# EAGLE design mapleCUL_small-V10_59 (EAGLE 7.6.0)
MAPLE-CUx Large Version
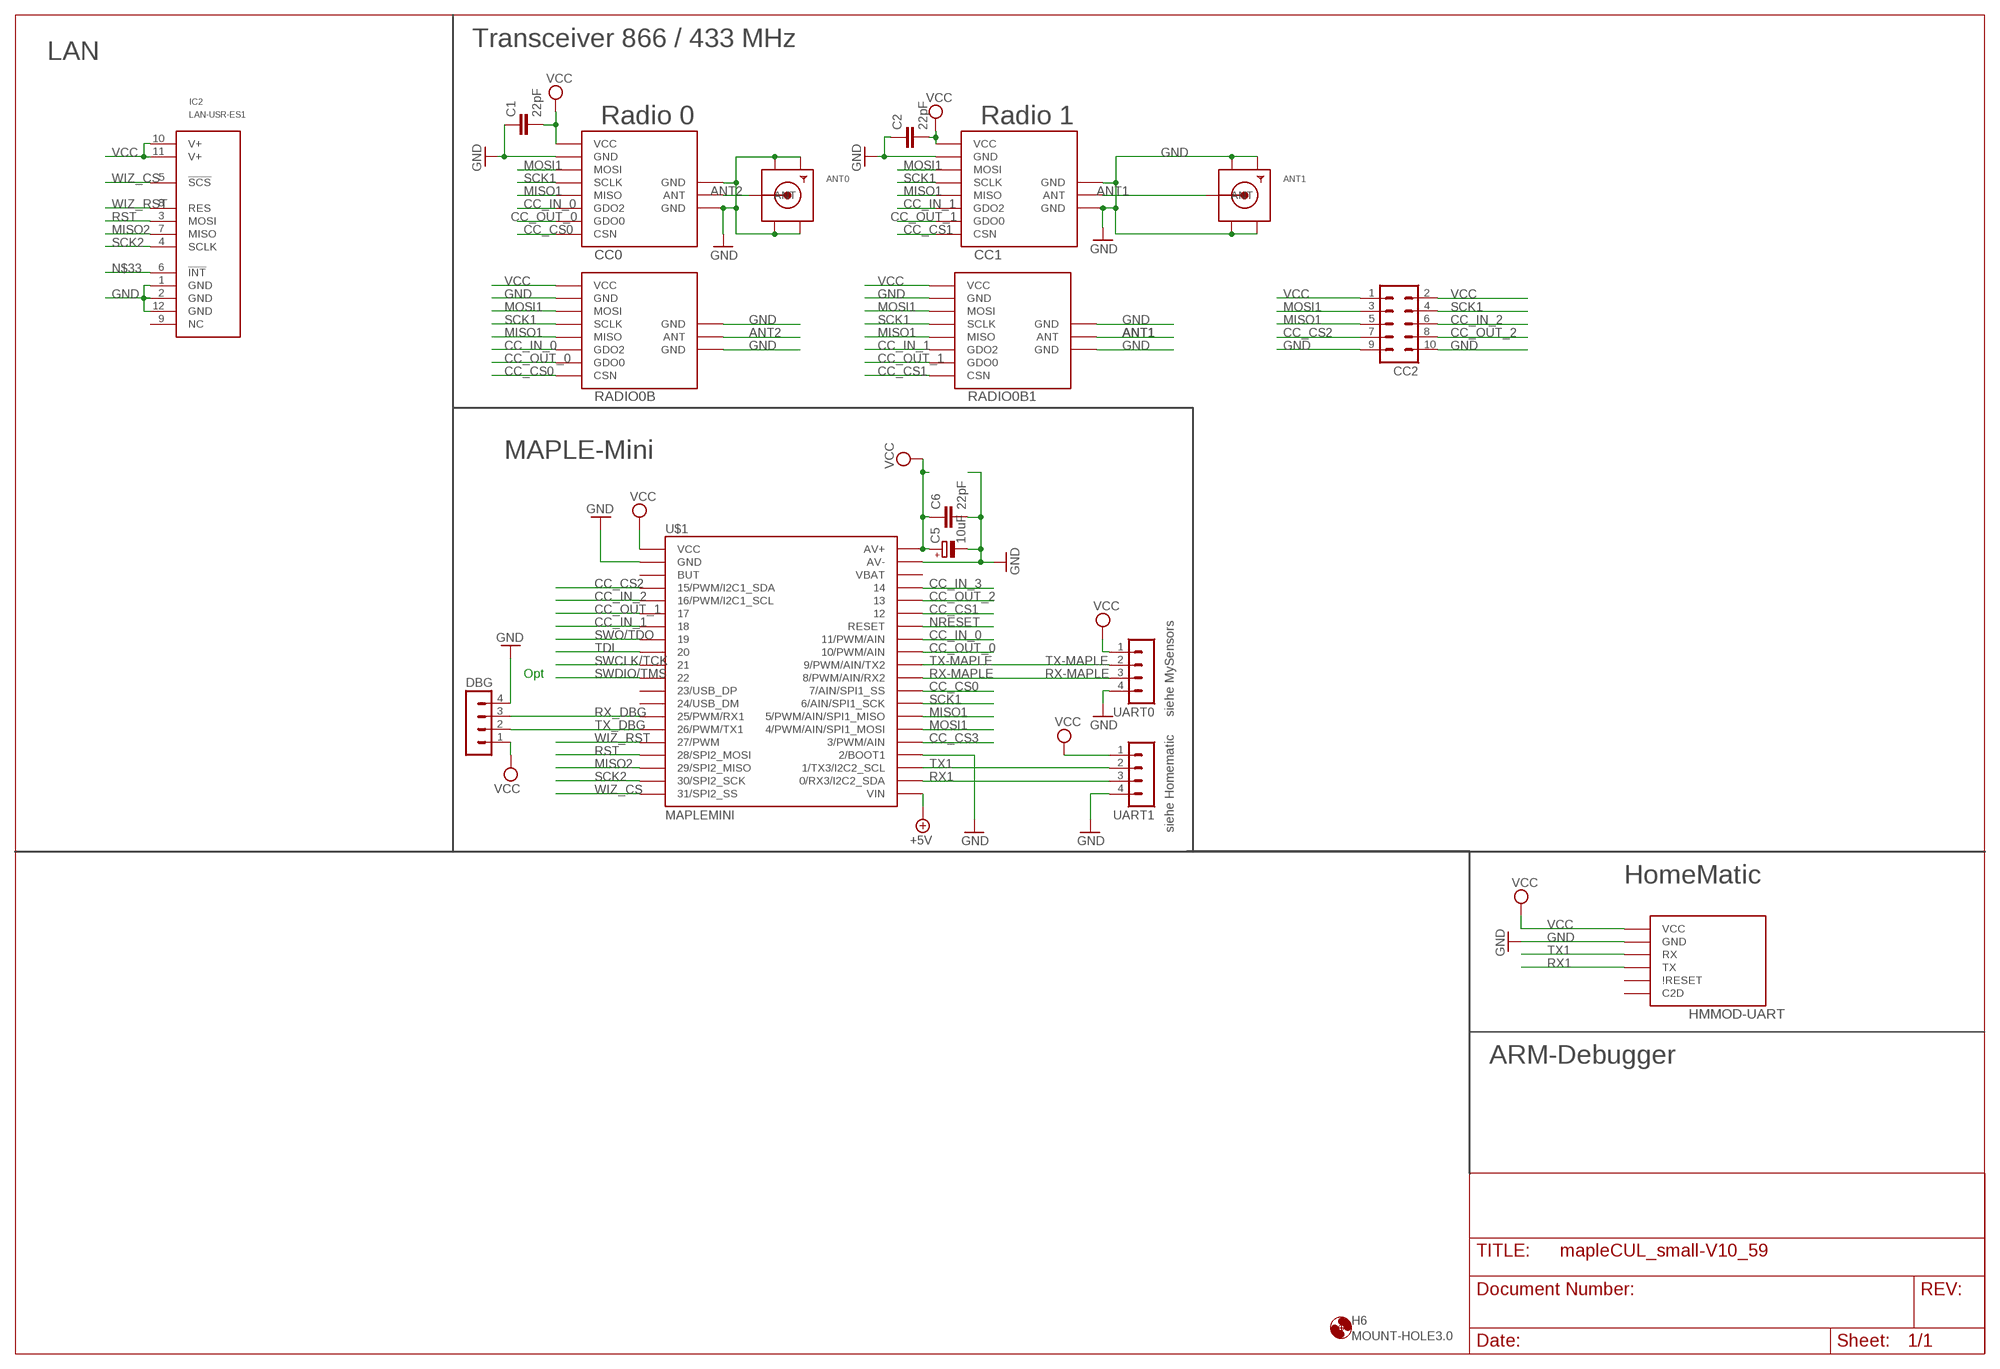
[diagram p0: schematic, sheet 1]

## Parts
ANT0  SMACONNECTOR_EDGE_UFL  [SMA_EDGELAUNCH_UFL]
ANT1  SMACONNECTOR_EDGE_UFL  [SMA_EDGELAUNCH_UFL]
C1  22pF  C-EUC0805  [C0805]
C2  22pF  C-EUC0805  [C0805]
C5  10uF  CPOL-EUR/2012-12W  [R/2012-12W]
C6  22pF  C-EUC0805  [C0805]
CC0  CC1101  CC1101_MODULE1SMD  [CC1101_MODULE1_SMD]
CC1  CC1101_MODULE1SMD  [CC1101_MODULE1_SMD]
CC2  MA05-2  [MA05-2]
DBG  MA04-1  [MA04-1]
H6  MOUNT-HOLE3.0  [3,0]
HMMOD-UART  HM-MOD-UARTDIL  [HM-MOD-UART-DIL]
IC2  LAN-USR-ES1  [USR-ES1]
RADIO0B  CC1101_MODULE1SMALL  [CC1101_MODULE1_SMD]
RADIO0B1  CC1101_MODULE1SMD  [CC1101_MODULE1_SMD]
U$1  MAPLEMINI  [20-DIP]
UART0  MA04-1  [MA04-1]
UART1  MA04-1  [MA04-1]

## Nets
+5V [PWR]: U$1.21(VIN)
ANT1 [PWR]: ANT1.P(ANT) CC1.ANT RADIO0B1.ANT
ANT2: ANT0.P(ANT) CC0.ANT RADIO0B.ANT
CC_CS0: CC0.CSN RADIO0B.CSN U$1.29(7/AIN/SPI1_SS)
CC_CS1: CC1.CSN RADIO0B1.CSN U$1.35
CC_CS2: CC2.7 U$1.4(15/PWM/I2C1_SDA)
CC_CS3: U$1.25(3/PWM/AIN)
CC_IN_0: CC0.GDO2 RADIO0B.GDO2 U$1.33(11/PWM/AIN)
CC_IN_1: CC1.GDO2 RADIO0B1.GDO2 U$1.7
CC_IN_2: CC2.6 U$1.5(16/PWM/I2C1_SCL)
CC_IN_3: U$1.37
CC_OUT_0: CC0.GDO0 RADIO0B.GDO0 U$1.32(10/PWM/AIN)
CC_OUT_1: CC1.GDO0 RADIO0B1.GDO0 U$1.6
CC_OUT_2: CC2.8 U$1.36
GND [PWR]: ANT0.GND@1(GND1) ANT0.GND@2(GND2) ANT0.GND@3(GND3) ANT0.GND@4(GND4) ANT1.GND@1(GND1) ANT1.GND@2(GND2) ANT1.GND@3(GND3) ANT1.GND@4(GND4) C1.1 C2.1 C5.- C6.2 CC0.GND@0(GND) CC0.GND@1(GND) CC0.GND@2(GND) CC1.GND@0(GND) CC1.GND@1(GND) CC1.GND@2(GND) CC2.9 CC2.10 DBG.4 HMMOD-UART.2(GND) IC2.1(GND) IC2.2(GND) IC2.12(GND) RADIO0B1.GND@0(GND) RADIO0B1.GND@1(GND) RADIO0B1.GND@2(GND) RADIO0B.GND@0(GND) RADIO0B.GND@1(GND) RADIO0B.GND@2(GND) U$1.2(GND) U$1.24(2/BOOT1) U$1.39(AV-) UART0.4 UART1.4
MISO1: CC0.MISO CC1.MISO CC2.5 RADIO0B1.MISO RADIO0B.MISO U$1.27(5/PWM/AIN/SPI1_MISO)
MISO2: IC2.7(MISO) U$1.18(29/SPI2_MISO)
MOSI1: CC0.MOSI CC1.MOSI CC2.3 RADIO0B1.MOSI RADIO0B.MOSI U$1.26(4/PWM/AIN/SPI1_MOSI)
N$33: IC2.6(!INT!)
NRESET: U$1.34(RESET)
RST: IC2.3(MOSI) U$1.17(28/SPI2_MOSI)
RX1: HMMOD-UART.5(TX) U$1.22(0/RX3/I2C2_SDA) UART1.3
RX-MAPLE: U$1.30(8/PWM/AIN/RX2) UART0.3
RX_DBG: DBG.3 U$1.14(25/PWM/RX1)
SCK1: CC0.SCLK CC1.SCLK CC2.4 RADIO0B1.SCLK RADIO0B.SCLK U$1.28(6/AIN/SPI1_SCK)
SCK2: IC2.4(SCLK) U$1.19(30/SPI2_SCK)
SWCLK/TCK: U$1.10
SWDIO/TMS: U$1.11
SWO/TDO: U$1.8
TDI: U$1.9
TX1: HMMOD-UART.6(RX) U$1.23(1/TX3/I2C2_SCL) UART1.2
TX-MAPLE: U$1.31(9/PWM/AIN/TX2) UART0.2
TX_DBG: DBG.2 U$1.15(26/PWM/TX1)
VCC [PWR]: C1.2 C2.2 C5.+ C6.1 CC0.VCC CC1.VCC CC2.1 CC2.2 DBG.1 HMMOD-UART.1(VCC) IC2.10(V+) IC2.11(V+) RADIO0B1.VCC RADIO0B.VCC U$1.1(VCC) U$1.40(AV+) UART0.1 UART1.1
WIZ_CS: IC2.5(!SCS!) U$1.20(31/SPI2_SS)
WIZ_RST: IC2.8(RES) U$1.16(27/PWM)
Unconnected: HMMOD-UART.3(C2D) HMMOD-UART.4(\!RESET) IC2.9(NC) U$1.3(BUT) U$1.12(23/USB_DP) U$1.13(24/USB_DM) U$1.38(VBAT)

## Notes on the sheet
- Transceiver 866 / 433 MHz
- LAN
- Radio 0 | Radio 1
- MAPLE-Mini
- Opt
- siehe MySensors
- siehe Homematic
- HomeMatic
- ARM-Debugger

## Library data of the parts
ANT0 ANT1 = adafruit:SMACONNECTOR: SMA Connector 90° DIP SMA Connector, 50 Ohm (4UConnector: 07259)
C1 C2 C6 = rcl:C-EU: CAPACITOR, European symbol
C5 = rcl:CPOL-EU: POLARIZED CAPACITOR, European symbol
CC0 CC1 = wireless:CC1101_MODULE1: CC1101 wireless module for 433/868 MHz (sold from Aliexpress). DIL version for mounting with pin header (and SMD soldering) and SMD only variant available.
CC2 = con-lstb:MA05-2: PIN HEADER; OC_FARNELL: unknown; OC_NEWARK: unknown
DBG UART0 UART1 = con-lstb:MA04-1: PIN HEADER; OC_FARNELL: unknown; OC_NEWARK: unknown
H6 = holes:MOUNT-HOLE: MOUNTING HOLE with drill center marker
HMMOD-UART = wireless:HM-MOD-UART: eQ3 HM-MOD-UART-AW-SH2 wireless module for 868 MHz. DIL version for mounting with pin header (antenna upwards) and SMD variant available (antenna downwards).
IC2 = Martin-Communication:LAN-USR-ES1
RADIO0B RADIO0B1 = Martin-Communication:CC1101_MODULE1: CC1101 wireless module for 433/868 MHz (sold from Aliexpress). DIL version for mounting with pin header (and SMD soldering) and SMD only variant available.
U$1 = maplemini-small:MAPLEMINI

## Net classes
0 default: width 0.305 mm
1 PWR: width 0.406 mm

## Board
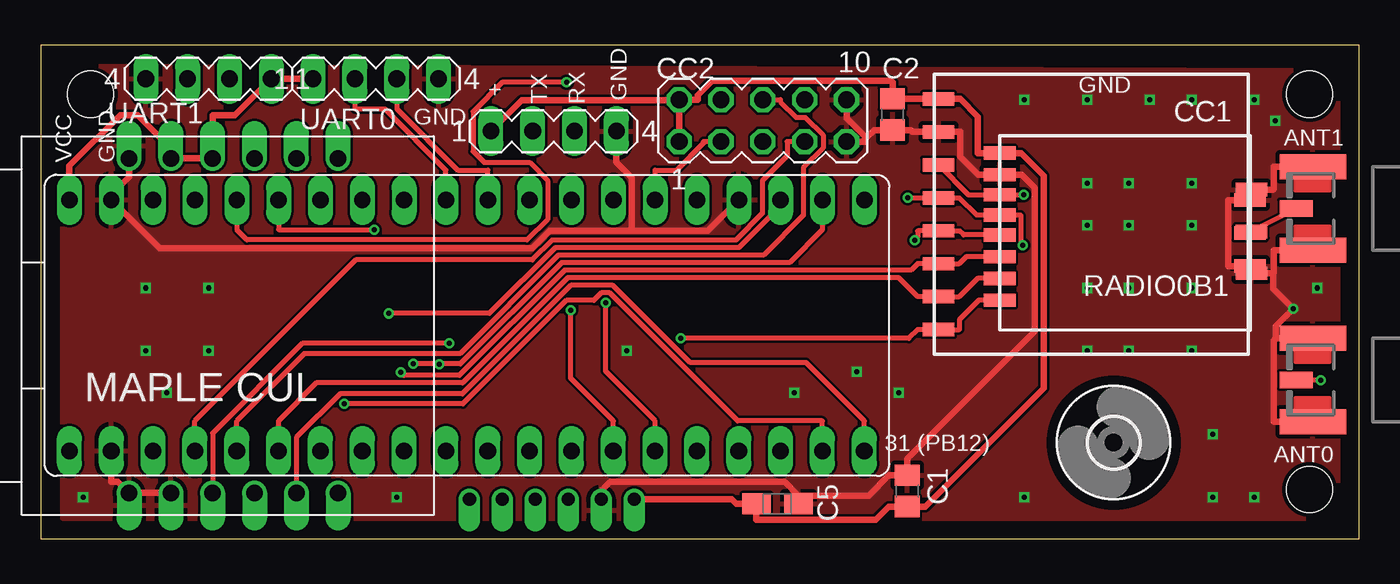
[diagram p1: board, top side]
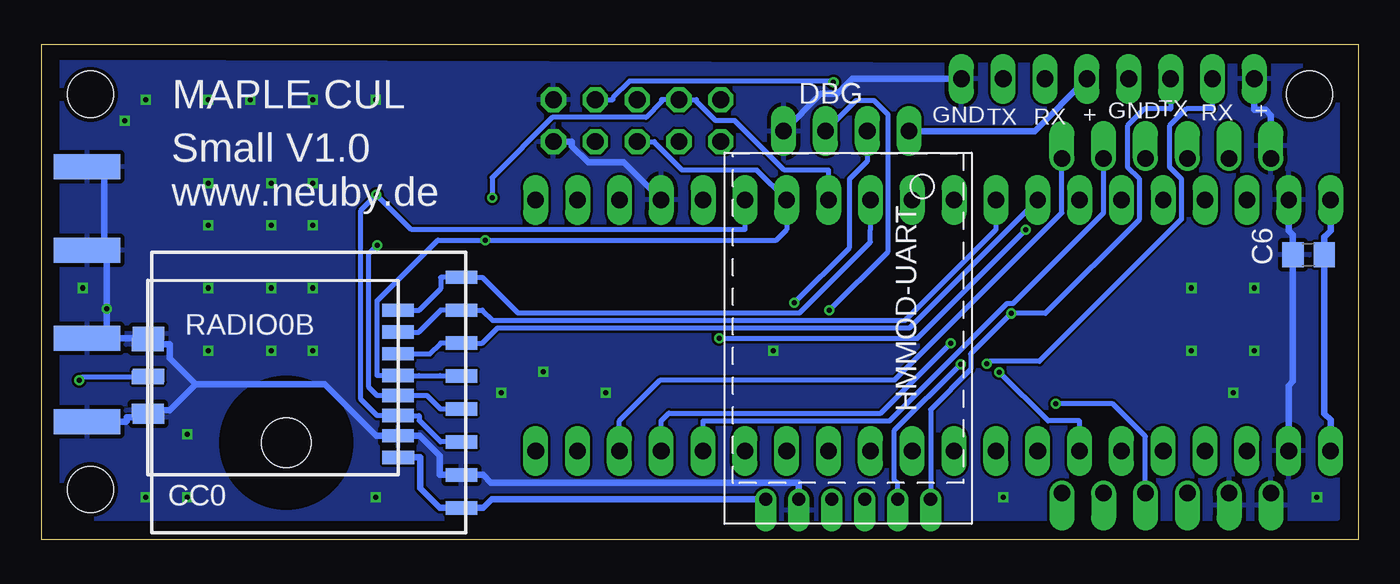
[diagram p2: board, bottom side, seen from below]

Size 80 x 30 mm. Coordinates in mm from the lower left corner, seen from the top.
Outline: 0,0 0,30 80,30 80,0 1,0 0,0
Copper layers (1*16): Top 0.035mm / dielectric 1.5mm / Bottom 0.035mm
Design rules "Fusion_eagle_rule_v1.1": minimum track width 6mil, minimum drill 12mil, track to track 6mil, track to pad 6mil, pad to pad 6mil, via to via 6mil, smd to smd 0mil, copper to edge 10mil, drill to drill 10mil, minimum pad ring 10mil, minimum via ring 6mil, stop-mask expansion 2mil, vias tented up to drill 100mil, thermal gap 10mil
Holes 2.8 mm at 3,27 77,27 77,3
tRestrict: 1 lines
bRestrict: 1 lines

### Footprints (pad centres in the part's own frame; a part is rotated, then mirrored left to right if it is on the bottom)
SMA_EDGELAUNCH_UFL = smd 4.064 x 1.524: GND@1 2.032,-2.54; GND@2 2.032,2.54 | smd 4.064 x 1.524 bottom: GND@3 2.032,2.54; GND@4 2.032,-2.54 | smd 2.032 x 1.016: P 3.048,0
C0805 = smd 1.3 x 1.5: 1 -0.95,0; 2 0.95,0
R/2012-12W = smd 1.75 x 1.26: + 1.275,0; - -1.275,0
CC1101_MODULE1_SMD = smd 1.93 x 0.813: ANT 19,5.96; CSN 0,0; GDO0 0,2; GDO2 0,4; GND@0 0,12; GND@1 19,8.5; GND@2 19,3.42; MISO 0,6; MOSI 0,10; SCLK 0,8; VCC 0,14
MA05-2 = drill 1.016 octagon: 1 -5.08,-1.27; 2 -5.08,1.27; 3 -2.54,-1.27; 4 -2.54,1.27; 5 0,-1.27; 6 0,1.27; 7 2.54,-1.27; 8 2.54,1.27; 9 5.08,-1.27; 10 5.08,1.27
MA04-1 = drill 1.016 long: 1 -3.81,0; 2 -1.27,0; 3 1.27,0; 4 3.81,0
3,0 = hole 3: 0,0
HM-MOD-UART-DIL = drill 0.8 offset: 1 0,12; 2 0,10; 3 0,8; 4 0,6; 5 0,4; 6 0,2
USR-ES1 = drill 1 pad 1.35 offset: 1 -10.16,5.715; 2 -10.16,3.175; 3 -10.16,0.635; 4 -10.16,-1.905; 5 -10.16,-4.445; 6 -10.16,-6.985; 7 10.16,-6.985; 8 10.16,-4.445; 9 10.16,-1.905; 10 10.16,0.635; 11 10.16,3.175; 12 10.16,5.715
CC1101_MODULE1_SMD' = smd 1.93 x 0.813: ANT 14.889,4.381; CSN -0.305,0.305; GDO0 -0.305,1.626; GDO2 -0.305,2.946; GND@0 -0.305,7.925; GND@1 14.889,6.381; GND@2 14.889,2.381; MISO -0.305,4.267; MOSI -0.305,6.706; SCLK -0.305,5.486; VCC -0.318,9.238
20-DIP = drill 1.016 pad 1.27 long: 1 -24.13,-7.62; 2 -21.59,-7.62; 3 -19.05,-7.62; 4 -16.51,-7.62; 5 -13.97,-7.62; 6 -11.43,-7.62; 7 -8.89,-7.62; 8 -6.35,-7.62; 9 -3.81,-7.62; 10 -1.27,-7.62; 11 1.27,-7.62; 12 3.81,-7.62; 13 6.35,-7.62; 14 8.89,-7.62; 15 11.43,-7.62; 16 13.97,-7.62; 17 16.51,-7.62; 18 19.05,-7.62; 19 21.59,-7.62; 20 24.13,-7.62 | drill 1 pad 1.27 long: 21 24.13,7.62; 22 21.59,7.62; 23 19.05,7.62; 24 16.51,7.62; 25 13.97,7.62; 26 11.43,7.62; 27 8.89,7.62; 28 6.35,7.62; 29 3.81,7.62; 30 1.27,7.62; 31 -1.27,7.62; 32 -3.81,7.62; 33 -6.35,7.62; 34 -8.89,7.62; 35 -11.43,7.62; 36 -13.97,7.62; 37 -16.51,7.62; 38 -19.05,7.62; 39 -21.59,7.62; 40 -24.13,7.62

### Placement (x,y rotation side)
ANT0  79.25,9.65 180 top
ANT1  79.25,20.07 180 top
C1  52.58,2.92 270 top
C2  51.69,25.78 90 top
C5  44.7,2.14 180 top
C6  3.05,17.26 180 bottom
CC0  54.48,15.89 180 bottom
CC1  54.48,12.72 0 top
CC2  43.81,25.4 0 top
DBG  31.11,24.77 0 top
H6  65.11,5.85 0 top
HMMOD-UART  24,2.41 90 bottom
IC2  11.05,12.95 90 top
RADIO0B  CC1101_MODULE1SMALL  [CC1101_MODULE1_SMD']  58.63,14.19 180 bottom
RADIO0B1  CC1101_MODULE1SMD  [CC1101_MODULE1_SMD']  58.51,14.19 0 top
U$1  25.84,12.97 0 top
UART0  20.32,27.94 0 top
UART1  10.16,27.94 180 top

### Tracks (layer width: path | path; a pad name or v marks a point on that pad's centre or on a via)
ANT1
  Top 0.305: CC1.ANT ANT1.P
  Top 0.406: RADIO0B1.ANT CC1.ANT
ANT2  (via drill 0.3 pad 0.61)
  Top 0.305: v77.7,9.65 ANT0.P
  Bottom 0.305: v77.7,9.65 77.54,9.81 RADIO0B.ANT 73.48,9.85 CC0.ANT
CC_CS0
  Bottom 0.305: RADIO0B.CSN 57.06,13.89 55.75,15.2 55.75,15.89 CC0.CSN 54.28,15.89 53.21,15.89 51.05,13.73 33.95,13.73 29.65,18.03 29.65,18.78 U$1.29
CC_CS1  (via drill 0.3 pad 0.61)
  Top 0.305: v38.83,12.19 52.69,12.19 53.21,12.72 CC1.CSN 55.75,12.72 55.75,13.32 56.93,14.5 RADIO0B1.CSN | v20.22,18.78 14.41,18.78 U$1.35
  Bottom 0.305: v38.83,12.19 26.81,12.19 v20.22,18.78
CC_CS2
  Top 0.305: CC2.7 45.29,24.13 45.29,23.25 43.79,21.75 43.79,19.77 42.17,18.15 31.02,18.15 29.82,16.94 19.1,16.94 9.34,7.18 U$1.4
CC_IN_0
  Bottom 0.305: U$1.33 27.27,12.81 52.29,12.81 53.21,11.89 CC0.GDO2 55.75,11.89 56.4,11.25 RADIO0B.GDO2
CC_IN_1  (via drill 0.3 pad 0.61)
  Top 0.305: v21.82,10.13 22.02,9.94 25.4,9.94 31.78,16.32 52.82,16.32 53.21,16.72 CC1.GDO2 55.75,16.72 56.18,17.14 RADIO0B1.GDO2
  Bottom 0.305: v21.82,10.13 18.87,7.18 16.95,7.18 U$1.7
CC_IN_2
  Top 0.305: CC2.6 44.88,26.67 44.88,26.56 45.84,25.6 46.4,25.6 47.47,24.53 47.47,23.73 46.28,22.55 46.28,19.66 43.86,17.24 31.4,17.24 25.43,11.26 15.96,11.26 11.87,7.18 U$1.5
CC_OUT_0
  Bottom 0.305: U$1.32 22.04,18.78 27.54,13.27 52.59,13.27 53.21,13.89 CC0.GDO0 55.75,13.89 57.06,12.58 57.06,12.57 RADIO0B.GDO0
CC_OUT_1
  Top 0.305: U$1.6 14.41,7.18 16.71,9.48 25.59,9.48 31.97,15.86 52.06,15.86 53.21,14.72 CC1.GDO0 55.75,14.72 56.86,15.82 RADIO0B1.GDO0
CC_OUT_2  (via drill 0.3 pad 0.61)
  Top 0.305: v31.89,27.73 27.99,27.73 26.22,25.95 26.22,23.54 26.9,22.86 29.65,22.86 30.74,21.77 30.74,19.39 29.51,18.16 12.49,18.16 11.87,18.78 U$1.36
  Bottom 0.305: CC2.8 45.29,26.67 45.29,26.78 44.27,27.8 31.97,27.8 v31.89,27.73
GND  (via drill 0.3 pad 0.61)
  Top 0.406: 35.87,18.72 30.88,18.72 29.8,17.65 7.2,17.65 U$1.39 4.25,20.93 5.33,22 IC2.12 | U$1.24 40.48,18.72 35.87,18.72 | 35.87,18.72 35.87,21.94 34.92,22.89 DBG.4 | U$1.2 4.25,3.47 4.66,3.47 IC2.1 IC2.2 | ANT1.GND@1 74.83,22.61 74.83,21.24 74.8,21.22 CC1.GND@1 73.48,20.66 RADIO0B1.GND@1 72.08,20.57 72.08,16.57 RADIO0B1.GND@2 73.4,16.22 CC1.GND@2 74.8,16.14 | ANT1.GND@3 74.83,17.53 74.83,16.16 74.8,16.14 | 74.8,16.14 74.8,15.2 v76.02,13.98 74.97,12.92 74.97,12.19 | 45.98,2.64 45.15,3.47 34.55,3.47 34,2.92 HMMOD-UART.2 | ANT0.GND@2 74.83,7.11 74.83,12.05 74.97,12.19 | 45.98,2.64 50.24,2.64 51.47,3.87 C1.1 52.58,4.88 60.32,12.62 60.32,21.32 59.52,22.12 RADIO0B1.GND@0 56.88,22.12 55.8,23.2 55.8,24.72 CC1.GND@0 52.91,24.72 52.8,24.83 C2.1 50.72,24.83 50.58,24.83 50.1,24.35 | C5.- 45.98,2.64 | ANT0.GND@1 74.97,12.19 | 50.1,24.35 50.01,24.26 50.01,24.13 CC2.9 | 50.1,24.35 48.9,25.55 CC2.10
  Bottom 0.406: 73.06,7.81 CC0.GND@1 74.8,7.39 74.8,7.14 74.83,7.11 ANT0.GND@2 | RADIO0B.GND@1 73.06,7.81 | 73.06,7.81 72.86,7.81 72.2,7.81 70.62,9.4 | CC2.9 47.78,24.13 47.78,23.86 46.8,22.88 44.64,22.88 U$1.24 | UART0.4 30.75,27.94 31.66,27.03 32.66,27.03 DBG.4 | U$1.39 4.25,18.73 4,18.47 C6.2 4,9.57 4.25,9.32 4.25,7.23 U$1.2 | 70.62,9.4 62.78,9.4 59.65,6.27 RADIO0B.GND@0 57.01,6.27 55.8,5.06 55.8,3.89 CC0.GND@0 53.82,3.89 53.16,3.89 52.69,3.42 34,3.42 HMMOD-UART.2 | 70.62,9.4 72.2,10.99 72.2,11.81 RADIO0B.GND@2 73.83,12.12 | ANT0.GND@1 76.62,12.19 76.02,12.19 | 76.02,12.19 v76.02,13.98 76.02,17.53 76.18,17.53 | 73.83,12.12 73.9,12.19 74.83,12.19 76.02,12.19 | 73.83,12.12 CC0.GND@2 | ANT1.GND@3 76.18,17.53 | ANT1.GND@1 76.18,22.61 76.18,17.53 | UART1.4 6.35,26.06 5.66,26.06 5.33,25.73 IC2.12
  other vias: 2.54,2.54 6.35,15.24 6.35,11.43 10.16,15.24 10.16,11.43 21.59,2.54 45.72,8.89 49.53,10.16 59.69,26.67 63.5,26.67 67.31,26.67 69.85,26.67 73.66,26.67 69.85,21.59 66.04,21.59 63.5,21.59 63.5,19.05 66.04,19.05 69.85,19.05 63.5,11.43 69.85,11.43 66.04,11.43 66.04,15.24 63.5,15.24 69.85,15.24 71.12,6.35 59.69,2.54 71.12,2.54 73.66,2.54 77.47,15.24 74.93,25.4 52.07,8.89 35.56,11.43 7.62,8.89
  pour Bottom: 1.27,29.21 78.74,29.21 78.74,1.27 1.27,1.27
  pour Top: 78.74,1.27 78.74,29.21 1.27,29.21 1.27,1.27
MISO1  (via drill 0.3 pad 0.61)
  Top 0.305: v53.03,18.15 53.21,18.33 53.21,18.72 CC1.MISO 55.75,18.72 56.01,18.46 RADIO0B1.MISO
  Bottom 0.305: CC2.5 42.75,24.13 42.75,24.07 41.08,22.4 36.55,22.4 U$1.27 34.73,18.78 35.36,18.15 v53.03,18.15 55.92,18.15 59.6,14.47 59.6,9.93 RADIO0B.MISO 57.06,9.93 55.79,9.93 55.75,9.89 CC0.MISO
MISO2
  Bottom 0.305: IC2.7 18.03,19.8 28.17,9.66 42.41,9.66 44.9,7.18 U$1.18
MOSI1  (via drill 0.3 pad 0.61)
  Top 0.305: v59.65,20.9 59.47,20.9 RADIO0B1.MOSI 56.3,20.9 CC1.MOSI | CC2.3 40.21,24.13 40.21,24.02 38.59,22.4 37.27,22.4 U$1.26
  Bottom 0.305: U$1.26 37.27,18.78 57.52,18.78 v59.65,20.9 60.59,19.95 60.59,8.48 59.6,7.49 RADIO0B.MOSI 57.7,7.49 57.06,7.49 57.06,7.2 55.75,5.89 CC0.MOSI
RST  (via drill 0.3 pad 0.61)
  Top 0.305: v24.78,11.87 15.86,11.87 10.41,6.42 IC2.3
  Bottom 0.305: U$1.17 42.35,7.18 41.9,7.64 29.02,7.64 v24.78,11.87
RX1  (via drill 0.3 pad 0.61)
  Top 0.305: 24.17,10.64 25.45,10.64 31.59,16.78 45.44,16.78 47.43,18.78 U$1.22 | 24.17,10.64 v24.17,10.62 | 24.17,10.64 v22.59,10.64
  Bottom 0.305: v22.59,10.64 22.45,10.78 19.4,10.78 10.78,19.4 10.78,21.86 11.51,22.59 11.51,25.08 10.48,26.11 8.89,26.11 UART1.3 | v24.17,10.62 28.19,6.6 28.19,3.56 28,3.37 HMMOD-UART.5
RX-MAPLE
  Top 0.305: U$1.30 27.11,22.4 25.3,22.4 21.59,26.11 UART0.3
RX_DBG  (via drill 0.3 pad 0.61)
  Top 0.305: v32.15,13.88 32.15,9.77 34.73,7.18 U$1.14
  Bottom 0.305: v32.15,13.88 28.57,17.45 28.57,25.77 29.42,26.61 30.54,26.61 DBG.3
SCK1  (via drill 0.3 pad 0.61)
  Top 0.305: v52.63,20.72 CC1.SCLK 55.75,20.72 56.79,19.68 RADIO0B1.SCLK 59.47,19.68 59.47,17.95 v59.59,17.83
  Bottom 0.305: U$1.28 32.19,22.4 34.88,22.4 37.88,25.4 39.05,25.4 40.21,26.56 40.21,26.67 CC2.4 42.34,26.67 42.34,26.54 43.27,25.6 48.97,25.6 52.63,21.95 v52.63,20.72 | v59.59,17.83 60.1,17.33 60.1,9.2 59.6,8.71 RADIO0B.SCLK 56.57,8.71 55.75,7.89 CC0.SCLK
SCK2  (via drill 0.3 pad 0.61)
  Top 0.305: 33.55,14.49 34.01,14.95 34.52,14.95 42.29,7.18 47.43,7.18 U$1.19 | 33.55,14.49 | 33.55,14.49 31.89,14.49 25.61,8.21 v18.41,8.21
  Bottom 0.305: IC2.4 12.95,6.23 14.93,8.21 v18.41,8.21
TX1  (via drill 0.3 pad 0.61)
  Top 0.305: U$1.23 44.9,20.23 42.36,17.69 31.21,17.69 27.21,13.69 v21.11,13.69
  Bottom 0.305: HMMOD-UART.6 26,7.85 23.56,10.29 23.56,11.24 v21.11,13.69 19.03,13.69 13.34,19.38 13.34,21.89 14.04,22.59 14.04,25.08 13.02,26.11 11.43,26.11 UART1.2
TX-MAPLE
  Top 0.305: U$1.31 24.57,22.4 20.87,26.11 19.05,26.11 UART0.2
TX_DBG  (via drill 0.3 pad 0.61)
  Top 0.305: v34.27,14.34 34.27,10.19 37.27,7.18 U$1.15
  Bottom 0.305: v34.27,14.34 30.91,17.69 30.91,21.87 29.84,22.94 DBG.2
VCC
  Top 0.406: 38.73,26.64 CC2.2 39.85,26.67 39.85,26.95 40.73,27.83 51.6,27.83 51.69,27.74 C2.2 52.8,26.73 52.81,26.72 CC1.VCC 55.8,26.72 56.87,25.65 56.87,23.43 RADIO0B1.VCC 59.51,23.43 60.88,22.06 60.88,9.17 53.68,1.97 C1.2 52.02,1.97 51.47,1.97 50.66,1.16 43.43,1.16 C5.+ 42.2,2.14 41.93,2.41 HMMOD-UART.1 | U$1.40 1.71,22.65 4.8,25.74 5.85,25.74 7.87,23.71 IC2.11 IC2.10 10.41,25.73 11.76,25.73 UART1.1 UART0.1 | 38.73,26.64 29.18,26.64 DBG.1 | CC2.1 38.73,26.64
  Bottom 0.406: UART0.1 19.68,24.77 DBG.1 | HMMOD-UART.1 52.64,2.41 53.16,1.89 CC0.VCC 55.8,1.89 57,3.08 57,4.96 RADIO0B.VCC | U$1.40 1.71,18.73 2.08,18.36 2.1,18.36 C6.1 2.1,16.15 2.1,7.61 1.71,7.23 U$1.1
WIZ_CS
  Top 0.305: IC2.5 15.49,6.17 18.15,8.82 25.57,8.82 32.16,15.41 34.71,15.41 39.41,10.7 46.45,10.7 49.97,7.18 U$1.20
WIZ_RST
  Bottom 0.305: IC2.8 15.49,19.8 20.99,14.3 21.36,14.3 28.48,7.18 39.81,7.18 U$1.16

### Text on the board
tNames: TX | RX | GND | + | GND | GND | VCC | GND | MAPLE CUL | 31 (PB12)
bNames: + | RX | TX | GND | RX | MAPLE CUL | + | TX | GND | Small V1.0 / www.neuby.de